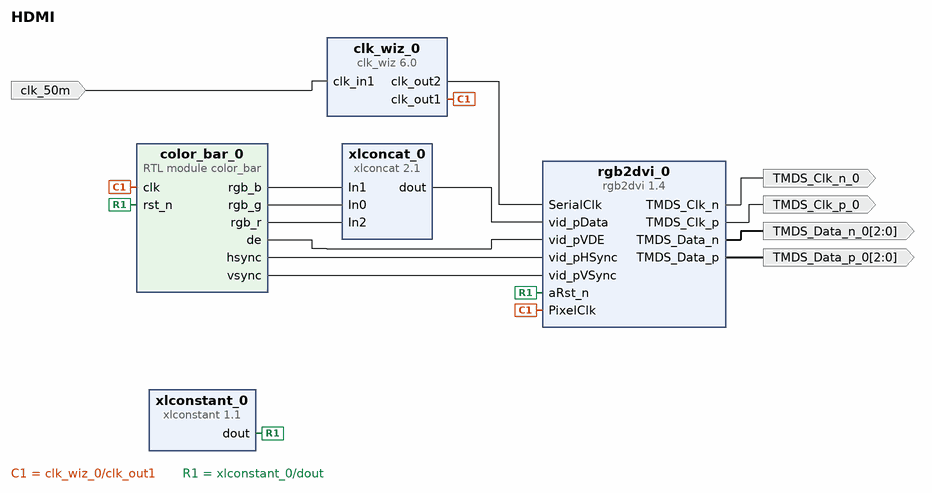
[diagram p0: block diagram of the top level]
# Vivado block design HDMI, xc7z020clg484-1, Vivado 2023.1
create_bd_design HDMI

create_bd_port -dir I -type clk clk_50m
set_property -dict {CONFIG.FREQ_HZ 50000000} [get_bd_ports clk_50m]
create_bd_port -dir O -type clk TMDS_Clk_n_0
create_bd_port -dir O -from 2 -to 0 TMDS_Data_p_0
create_bd_port -dir O -type clk TMDS_Clk_p_0
create_bd_port -dir O -from 2 -to 0 TMDS_Data_n_0

create_bd_cell -type ip -vlnv xilinx.com:ip:clk_wiz:6.0 clk_wiz_0
set_property -dict [list \
  CONFIG.CLKIN1_JITTER_PS 200.0 \
  CONFIG.CLKOUT1_JITTER 204.383 \
  CONFIG.CLKOUT1_PHASE_ERROR 164.985 \
  CONFIG.CLKOUT1_REQUESTED_OUT_FREQ 40 \
  CONFIG.CLKOUT2_JITTER 142.107 \
  CONFIG.CLKOUT2_PHASE_ERROR 164.985 \
  CONFIG.CLKOUT2_REQUESTED_OUT_FREQ 200 \
  CONFIG.CLKOUT2_USED true \
  CONFIG.MMCM_CLKFBOUT_MULT_F 20.000 \
  CONFIG.MMCM_CLKIN1_PERIOD 20.000 \
  CONFIG.MMCM_CLKIN2_PERIOD 10.0 \
  CONFIG.MMCM_CLKOUT0_DIVIDE_F 25.000 \
  CONFIG.MMCM_CLKOUT1_DIVIDE 5 \
  CONFIG.MMCM_DIVCLK_DIVIDE 1 \
  CONFIG.NUM_OUT_CLKS 2 \
  CONFIG.PRIM_IN_FREQ 50 \
  CONFIG.USE_LOCKED false \
  CONFIG.USE_RESET false \
] [get_bd_cells clk_wiz_0]
create_bd_cell -type ip -vlnv digilentinc.com:ip:rgb2dvi:1.4 rgb2dvi_0
set_property -dict {CONFIG.kGenerateSerialClk false CONFIG.kRstActiveHigh false} [get_bd_cells rgb2dvi_0]
create_bd_cell -type ip -vlnv xilinx.com:ip:xlconstant:1.1 xlconstant_0
create_bd_cell -type ip -vlnv xilinx.com:ip:xlconcat:2.1 xlconcat_0
set_property -dict {CONFIG.IN0_WIDTH 8 CONFIG.IN1_WIDTH 8 CONFIG.IN2_WIDTH 8 CONFIG.NUM_PORTS 3} [get_bd_cells xlconcat_0]
create_bd_cell -type module -reference color_bar color_bar_0

# ---- connections ----

connect_bd_net [get_bd_ports clk_50m] [get_bd_pins clk_wiz_0/clk_in1]
connect_bd_net [get_bd_pins clk_wiz_0/clk_out1] [get_bd_pins rgb2dvi_0/PixelClk] [get_bd_pins color_bar_0/clk]
connect_bd_net [get_bd_pins clk_wiz_0/clk_out2] [get_bd_pins rgb2dvi_0/SerialClk]
connect_bd_net [get_bd_pins color_bar_0/de] [get_bd_pins rgb2dvi_0/vid_pVDE]
connect_bd_net [get_bd_pins color_bar_0/hsync] [get_bd_pins rgb2dvi_0/vid_pHSync]
connect_bd_net [get_bd_pins color_bar_0/rgb_b] [get_bd_pins xlconcat_0/In1]
connect_bd_net [get_bd_pins color_bar_0/rgb_g] [get_bd_pins xlconcat_0/In0]
connect_bd_net [get_bd_pins color_bar_0/rgb_r] [get_bd_pins xlconcat_0/In2]
connect_bd_net [get_bd_pins color_bar_0/vsync] [get_bd_pins rgb2dvi_0/vid_pVSync]
connect_bd_net [get_bd_pins rgb2dvi_0/TMDS_Clk_n] [get_bd_ports TMDS_Clk_n_0]
connect_bd_net [get_bd_pins rgb2dvi_0/TMDS_Clk_p] [get_bd_ports TMDS_Clk_p_0]
connect_bd_net [get_bd_pins rgb2dvi_0/TMDS_Data_n] [get_bd_ports TMDS_Data_n_0]
connect_bd_net [get_bd_pins rgb2dvi_0/TMDS_Data_p] [get_bd_ports TMDS_Data_p_0]
connect_bd_net [get_bd_pins xlconcat_0/dout] [get_bd_pins rgb2dvi_0/vid_pData]
connect_bd_net [get_bd_pins xlconstant_0/dout] [get_bd_pins rgb2dvi_0/aRst_n] [get_bd_pins color_bar_0/rst_n]

validate_bd_design
save_bd_design
